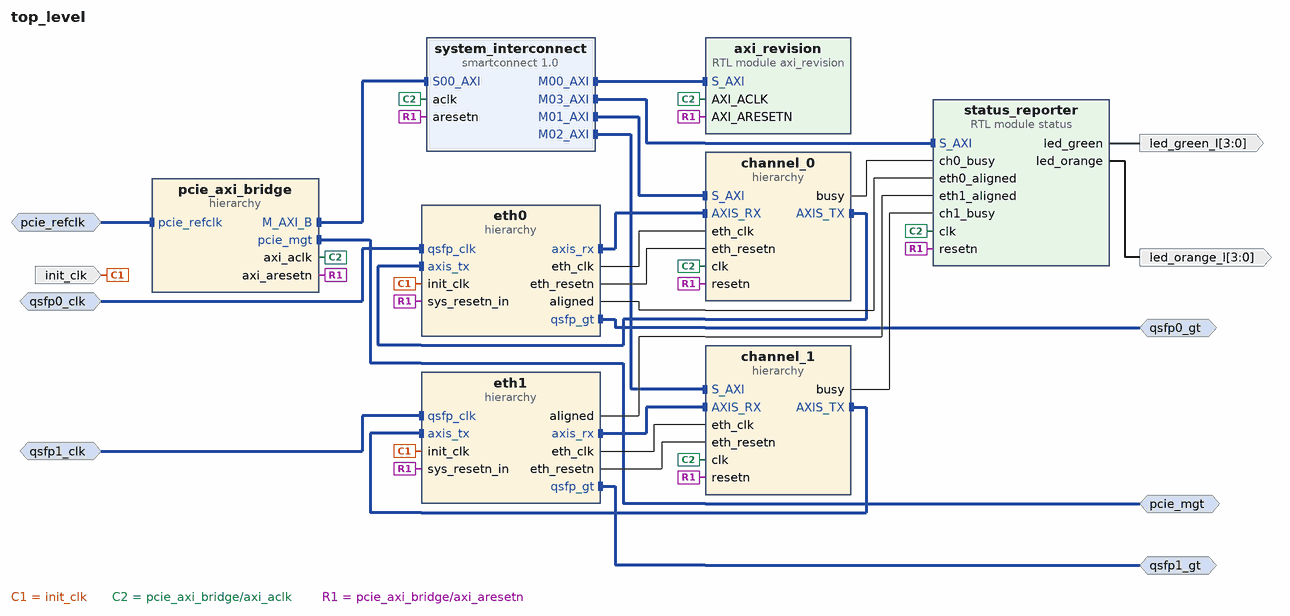
[diagram p0: block diagram of the top level]
# Vivado block design top_level, xcvu3p-ffvc1517-2-e, Vivado 2021.1
create_bd_design top_level

create_bd_intf_port -mode Slave -vlnv xilinx.com:interface:diff_clock_rtl:1.0 pcie_refclk
create_bd_intf_port -mode Master -vlnv xilinx.com:interface:pcie_7x_mgt_rtl:1.0 pcie_mgt
create_bd_intf_port -mode Master -vlnv xilinx.com:interface:gt_rtl:1.0 qsfp0_gt
create_bd_intf_port -mode Slave -vlnv xilinx.com:interface:diff_clock_rtl:1.0 qsfp0_clk
set_property -dict {CONFIG.FREQ_HZ 322265625} [get_bd_intf_ports qsfp0_clk]
create_bd_intf_port -mode Master -vlnv xilinx.com:interface:gt_rtl:1.0 qsfp1_gt
create_bd_intf_port -mode Slave -vlnv xilinx.com:interface:diff_clock_rtl:1.0 qsfp1_clk
set_property -dict {CONFIG.FREQ_HZ 322265625} [get_bd_intf_ports qsfp1_clk]
create_bd_port -dir I -type clk init_clk
create_bd_port -dir O -from 3 -to 0 led_green_l
create_bd_port -dir O -from 3 -to 0 led_orange_l

create_bd_cell -type hier pcie_axi_bridge
create_bd_cell -type ip -vlnv xilinx.com:ip:smartconnect:1.0 system_interconnect
set_property -dict {CONFIG.NUM_MI 4 CONFIG.NUM_SI 1} [get_bd_cells system_interconnect]
create_bd_cell -type hier eth0
create_bd_cell -type hier channel_0
create_bd_cell -type hier eth1
create_bd_cell -type hier channel_1
create_bd_cell -type module -reference axi_revision axi_revision
create_bd_cell -type module -reference status status_reporter
set_property -dict {CONFIG.ACTIVE_LOW_LED 1} [get_bd_cells status_reporter]

# ---- hierarchy /pcie_axi_bridge ----
current_bd_instance /pcie_axi_bridge
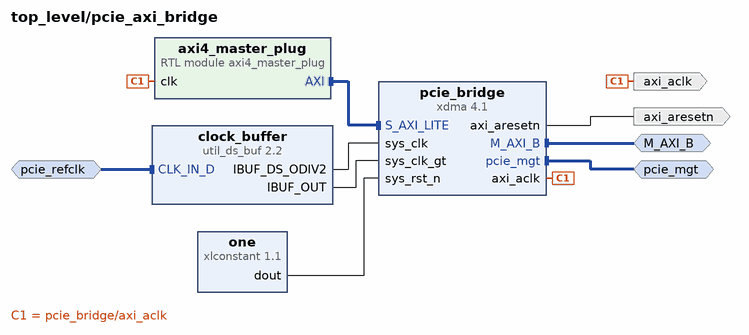
[diagram p1: block diagram inside /pcie_axi_bridge]
create_bd_intf_pin -mode Master -vlnv xilinx.com:interface:pcie_7x_mgt_rtl:1.0 pcie_mgt
create_bd_intf_pin -mode Slave -vlnv xilinx.com:interface:diff_clock_rtl:1.0 pcie_refclk
create_bd_intf_pin -mode Master -vlnv xilinx.com:interface:aximm_rtl:1.0 M_AXI_B
create_bd_pin -dir O axi_aresetn
create_bd_pin -dir O axi_aclk

create_bd_cell -type ip -vlnv xilinx.com:ip:xdma:4.1 pcie_bridge
set_property -dict [list \
  CONFIG.PF0_DEVICE_ID_mqdma 903F \
  CONFIG.PF0_SRIOV_VF_DEVICE_ID A03F \
  CONFIG.PF2_DEVICE_ID_mqdma 923F \
  CONFIG.PF3_DEVICE_ID_mqdma 933F \
  CONFIG.axi_addr_width 64 \
  CONFIG.axi_data_width 512_bit \
  CONFIG.axisten_freq 250 \
  CONFIG.bridge_burst true \
  CONFIG.en_axi_slave_if false \
  CONFIG.functional_mode AXI_Bridge \
  CONFIG.mode_selection Advanced \
  CONFIG.pf0_bar0_scale Megabytes \
  CONFIG.pf0_bar0_size 1 \
  CONFIG.pf0_device_id 903F \
  CONFIG.pl_link_cap_max_link_speed 8.0_GT/s \
  CONFIG.pl_link_cap_max_link_width X16 \
  CONFIG.plltype QPLL1 \
] [get_bd_cells pcie_bridge]
create_bd_cell -type ip -vlnv xilinx.com:ip:util_ds_buf:2.2 clock_buffer
set_property -dict {CONFIG.C_BUF_TYPE IBUFDSGTE} [get_bd_cells clock_buffer]
create_bd_cell -type ip -vlnv xilinx.com:ip:xlconstant:1.1 one
create_bd_cell -type module -reference axi4_master_plug axi4_master_plug

# ---- hierarchy /eth0 ----
current_bd_instance /eth0
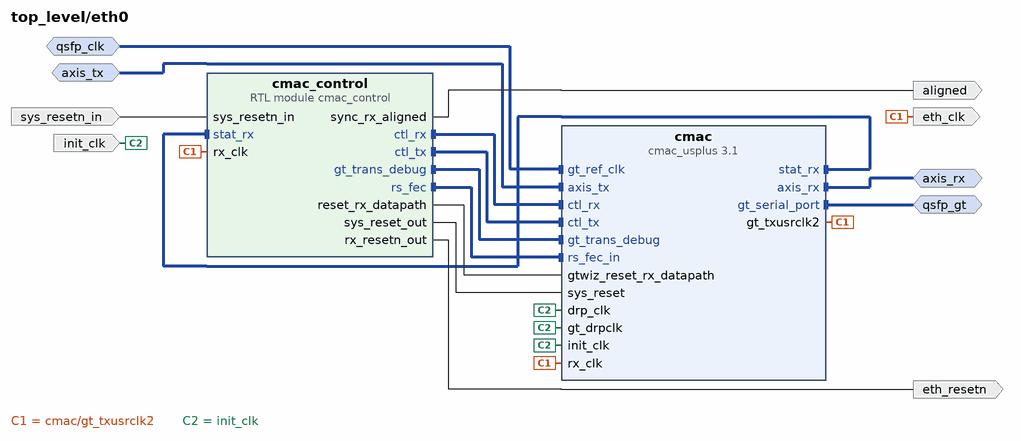
[diagram p2: block diagram inside /eth0]
create_bd_intf_pin -mode Master -vlnv xilinx.com:interface:gt_rtl:1.0 qsfp_gt
create_bd_intf_pin -mode Slave -vlnv xilinx.com:interface:diff_clock_rtl:1.0 qsfp_clk
create_bd_intf_pin -mode Master -vlnv xilinx.com:interface:axis_rtl:1.0 axis_rx
create_bd_intf_pin -mode Slave -vlnv xilinx.com:interface:axis_rtl:1.0 axis_tx
create_bd_pin -dir I -type clk init_clk
create_bd_pin -dir O eth_clk
create_bd_pin -dir O aligned
create_bd_pin -dir I sys_resetn_in
create_bd_pin -dir O eth_resetn

create_bd_cell -type ip -vlnv xilinx.com:ip:cmac_usplus:3.1 cmac
set_property -dict [list \
  CONFIG.ADD_GT_CNRL_STS_PORTS 1 \
  CONFIG.CMAC_CAUI4_MODE 1 \
  CONFIG.CMAC_CORE_SELECT CMACE4_X0Y2 \
  CONFIG.GT_GROUP_SELECT {X0Y16~X0Y19} \
  CONFIG.GT_REF_CLK_FREQ 322.265625 \
  CONFIG.INCLUDE_RS_FEC 1 \
  CONFIG.NUM_LANES 4x25 \
  CONFIG.RX_FLOW_CONTROL 0 \
  CONFIG.TX_FLOW_CONTROL 0 \
  CONFIG.USER_INTERFACE AXIS \
] [get_bd_cells cmac]
create_bd_cell -type module -reference cmac_control cmac_control

# ---- hierarchy /channel_0 ----
current_bd_instance /channel_0
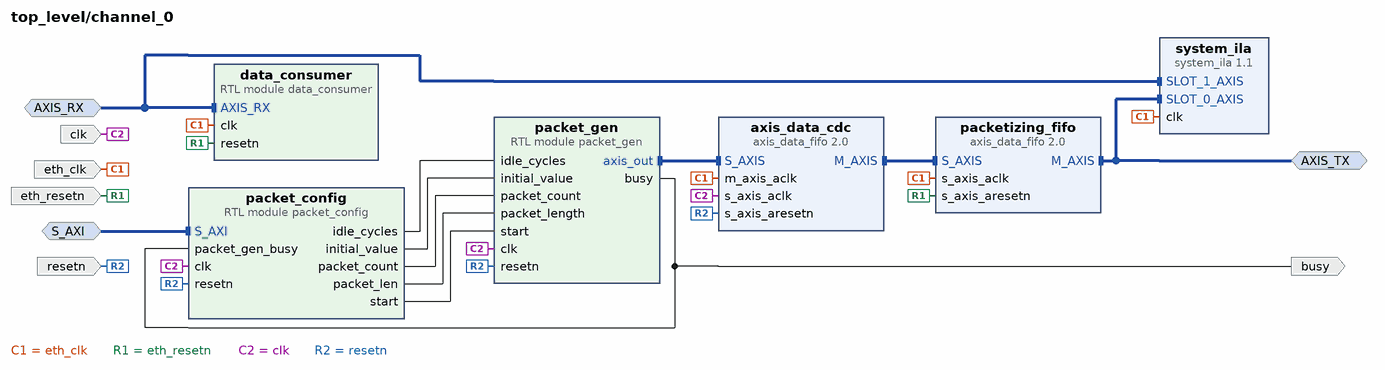
[diagram p3: block diagram inside /channel_0]
create_bd_intf_pin -mode Slave -vlnv xilinx.com:interface:aximm_rtl:1.0 S_AXI
create_bd_intf_pin -mode Master -vlnv xilinx.com:interface:axis_rtl:1.0 AXIS_TX
create_bd_intf_pin -mode Slave -vlnv xilinx.com:interface:axis_rtl:1.0 AXIS_RX
create_bd_pin -dir I -type rst resetn
create_bd_pin -dir I -type clk clk
create_bd_pin -dir I -type clk eth_clk
create_bd_pin -dir I -type rst eth_resetn
create_bd_pin -dir O busy

create_bd_cell -type ip -vlnv xilinx.com:ip:axis_data_fifo:2.0 axis_data_cdc
set_property -dict {CONFIG.FIFO_DEPTH 16 CONFIG.IS_ACLK_ASYNC 1} [get_bd_cells axis_data_cdc]
create_bd_cell -type module -reference packet_gen packet_gen
create_bd_cell -type ip -vlnv xilinx.com:ip:axis_data_fifo:2.0 packetizing_fifo
set_property -dict {CONFIG.FIFO_MODE 2} [get_bd_cells packetizing_fifo]
create_bd_cell -type module -reference data_consumer data_consumer
create_bd_cell -type ip -vlnv xilinx.com:ip:system_ila:1.1 system_ila
set_property -dict [list \
  CONFIG.C_NUM_MONITOR_SLOTS 2 \
  CONFIG.C_SLOT 1 \
  CONFIG.C_SLOT_0_INTF_TYPE xilinx.com:interface:axis_rtl:1.0 \
  CONFIG.C_SLOT_1_INTF_TYPE xilinx.com:interface:axis_rtl:1.0 \
] [get_bd_cells system_ila]
create_bd_cell -type module -reference packet_config packet_config

# ---- hierarchy /eth1 ----
current_bd_instance /eth1
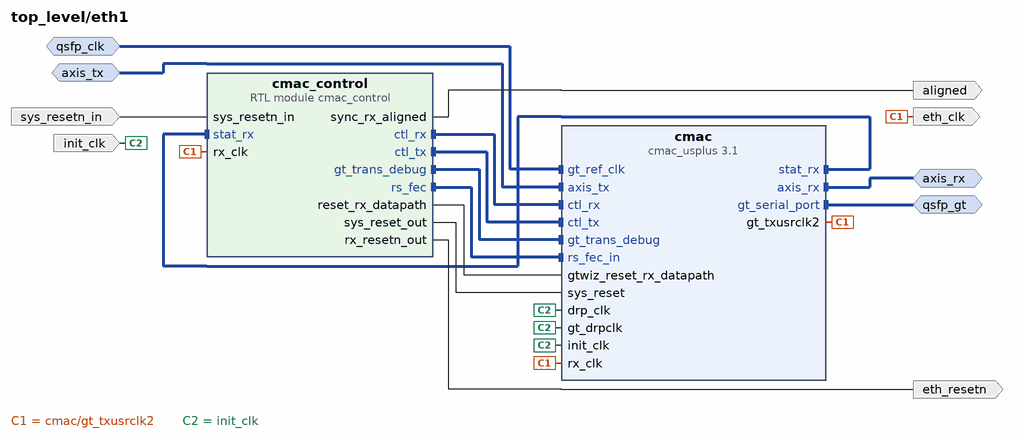
[diagram p4: block diagram inside /eth1]
create_bd_intf_pin -mode Master -vlnv xilinx.com:interface:gt_rtl:1.0 qsfp_gt
create_bd_intf_pin -mode Slave -vlnv xilinx.com:interface:diff_clock_rtl:1.0 qsfp_clk
create_bd_intf_pin -mode Master -vlnv xilinx.com:interface:axis_rtl:1.0 axis_rx
create_bd_intf_pin -mode Slave -vlnv xilinx.com:interface:axis_rtl:1.0 axis_tx
create_bd_pin -dir I -type clk init_clk
create_bd_pin -dir O eth_clk
create_bd_pin -dir O aligned
create_bd_pin -dir I sys_resetn_in
create_bd_pin -dir O eth_resetn

create_bd_cell -type ip -vlnv xilinx.com:ip:cmac_usplus:3.1 cmac
set_property -dict [list \
  CONFIG.ADD_GT_CNRL_STS_PORTS 1 \
  CONFIG.CMAC_CAUI4_MODE 1 \
  CONFIG.CMAC_CORE_SELECT CMACE4_X0Y0 \
  CONFIG.GT_GROUP_SELECT {X0Y4~X0Y7} \
  CONFIG.GT_REF_CLK_FREQ 322.265625 \
  CONFIG.INCLUDE_RS_FEC 1 \
  CONFIG.NUM_LANES 4x25 \
  CONFIG.RX_FLOW_CONTROL 0 \
  CONFIG.TX_FLOW_CONTROL 0 \
  CONFIG.USER_INTERFACE AXIS \
] [get_bd_cells cmac]
create_bd_cell -type module -reference cmac_control cmac_control

# ---- hierarchy /channel_1 ----
current_bd_instance /channel_1
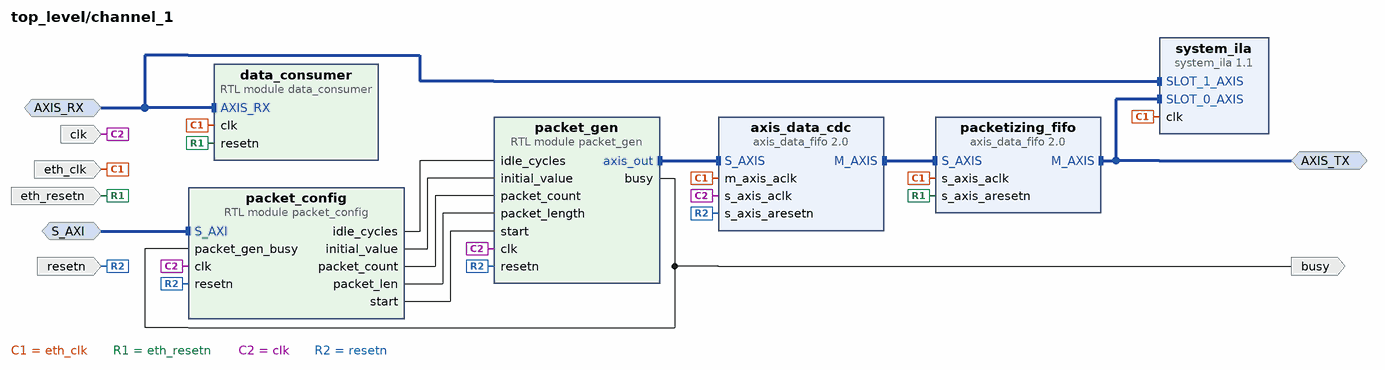
[diagram p5: block diagram inside /channel_1]
create_bd_intf_pin -mode Slave -vlnv xilinx.com:interface:aximm_rtl:1.0 S_AXI
create_bd_intf_pin -mode Master -vlnv xilinx.com:interface:axis_rtl:1.0 AXIS_TX
create_bd_intf_pin -mode Slave -vlnv xilinx.com:interface:axis_rtl:1.0 AXIS_RX
create_bd_pin -dir I -type rst resetn
create_bd_pin -dir I -type clk clk
create_bd_pin -dir I -type clk eth_clk
create_bd_pin -dir I -type rst eth_resetn
create_bd_pin -dir O busy

create_bd_cell -type ip -vlnv xilinx.com:ip:axis_data_fifo:2.0 axis_data_cdc
set_property -dict {CONFIG.FIFO_DEPTH 16 CONFIG.IS_ACLK_ASYNC 1} [get_bd_cells axis_data_cdc]
create_bd_cell -type module -reference packet_gen packet_gen
create_bd_cell -type ip -vlnv xilinx.com:ip:axis_data_fifo:2.0 packetizing_fifo
set_property -dict {CONFIG.FIFO_MODE 2} [get_bd_cells packetizing_fifo]
create_bd_cell -type module -reference data_consumer data_consumer
create_bd_cell -type ip -vlnv xilinx.com:ip:system_ila:1.1 system_ila
set_property -dict [list \
  CONFIG.C_NUM_MONITOR_SLOTS 2 \
  CONFIG.C_SLOT 1 \
  CONFIG.C_SLOT_0_INTF_TYPE xilinx.com:interface:axis_rtl:1.0 \
  CONFIG.C_SLOT_1_INTF_TYPE xilinx.com:interface:axis_rtl:1.0 \
] [get_bd_cells system_ila]
create_bd_cell -type module -reference packet_config packet_config
set_property -dict {CONFIG.DEFAULT_INIT_VALUE 0x8000} [get_bd_cells packet_config]

# ---- connections ----

current_bd_instance /pcie_axi_bridge
connect_bd_intf_net [get_bd_intf_pins pcie_refclk] [get_bd_intf_pins clock_buffer/CLK_IN_D]
connect_bd_intf_net [get_bd_intf_pins M_AXI_B] [get_bd_intf_pins pcie_bridge/M_AXI_B]
connect_bd_intf_net [get_bd_intf_pins axi4_master_plug/AXI] [get_bd_intf_pins pcie_bridge/S_AXI_LITE]
connect_bd_intf_net [get_bd_intf_pins pcie_mgt] [get_bd_intf_pins pcie_bridge/pcie_mgt]
connect_bd_net [get_bd_pins pcie_bridge/axi_aclk] [get_bd_pins axi_aclk] [get_bd_pins axi4_master_plug/clk]
connect_bd_net [get_bd_pins pcie_bridge/axi_aresetn] [get_bd_pins axi_aresetn]
connect_bd_net -net util_ds_buf_0_IBUF_DS_ODIV2 [get_bd_pins clock_buffer/IBUF_DS_ODIV2] [get_bd_pins pcie_bridge/sys_clk]
connect_bd_net -net util_ds_buf_0_IBUF_OUT [get_bd_pins clock_buffer/IBUF_OUT] [get_bd_pins pcie_bridge/sys_clk_gt]
connect_bd_net -net xlconstant_0_dout [get_bd_pins one/dout] [get_bd_pins pcie_bridge/sys_rst_n]

current_bd_instance /eth0
connect_bd_intf_net [get_bd_intf_pins qsfp_gt] [get_bd_intf_pins cmac/gt_serial_port]
connect_bd_intf_net [get_bd_intf_pins qsfp_clk] [get_bd_intf_pins cmac/gt_ref_clk]
connect_bd_intf_net [get_bd_intf_pins axis_tx] [get_bd_intf_pins cmac/axis_tx]
connect_bd_intf_net [get_bd_intf_pins axis_rx] [get_bd_intf_pins cmac/axis_rx]
connect_bd_intf_net [get_bd_intf_pins cmac_control/ctl_rx] [get_bd_intf_pins cmac/ctl_rx]
connect_bd_intf_net [get_bd_intf_pins cmac_control/ctl_tx] [get_bd_intf_pins cmac/ctl_tx]
connect_bd_intf_net [get_bd_intf_pins cmac_control/gt_trans_debug] [get_bd_intf_pins cmac/gt_trans_debug]
connect_bd_intf_net [get_bd_intf_pins cmac_control/rs_fec] [get_bd_intf_pins cmac/rs_fec_in]
connect_bd_intf_net [get_bd_intf_pins cmac_control/stat_rx] [get_bd_intf_pins cmac/stat_rx]
connect_bd_net [get_bd_pins cmac_control/reset_rx_datapath] [get_bd_pins cmac/gtwiz_reset_rx_datapath]
connect_bd_net [get_bd_pins cmac_control/rx_resetn_out] [get_bd_pins eth_resetn]
connect_bd_net [get_bd_pins cmac_control/sync_rx_aligned] [get_bd_pins aligned]
connect_bd_net [get_bd_pins cmac_control/sys_reset_out] [get_bd_pins cmac/sys_reset]
connect_bd_net [get_bd_pins cmac/gt_txusrclk2] [get_bd_pins eth_clk] [get_bd_pins cmac/rx_clk] [get_bd_pins cmac_control/rx_clk]
connect_bd_net -net init_clk_0_1 [get_bd_pins init_clk] [get_bd_pins cmac/init_clk] [get_bd_pins cmac/gt_drpclk] [get_bd_pins cmac/drp_clk]
connect_bd_net [get_bd_pins sys_resetn_in] [get_bd_pins cmac_control/sys_resetn_in]

current_bd_instance /channel_0
connect_bd_intf_net [get_bd_intf_pins axis_data_cdc/M_AXIS] [get_bd_intf_pins packetizing_fifo/S_AXIS]
connect_bd_intf_net [get_bd_intf_pins AXIS_RX] [get_bd_intf_pins data_consumer/AXIS_RX]
connect_bd_intf_net [get_bd_intf_pins AXIS_RX] [get_bd_intf_pins system_ila/SLOT_1_AXIS]
connect_bd_intf_net [get_bd_intf_pins AXIS_TX] [get_bd_intf_pins packetizing_fifo/M_AXIS]
connect_bd_intf_net [get_bd_intf_pins AXIS_TX] [get_bd_intf_pins system_ila/SLOT_0_AXIS]
connect_bd_intf_net [get_bd_intf_pins axis_data_cdc/S_AXIS] [get_bd_intf_pins packet_gen/axis_out]
connect_bd_intf_net [get_bd_intf_pins S_AXI] [get_bd_intf_pins packet_config/S_AXI]
connect_bd_net -net eth0_stream_clk [get_bd_pins eth_clk] \
  [get_bd_pins packetizing_fifo/s_axis_aclk] [get_bd_pins data_consumer/clk] [get_bd_pins axis_data_cdc/m_axis_aclk] \
  [get_bd_pins system_ila/clk]
connect_bd_net -net eth0_stream_resetn [get_bd_pins eth_resetn] [get_bd_pins packetizing_fifo/s_axis_aresetn] [get_bd_pins data_consumer/resetn]
connect_bd_net [get_bd_pins packet_config/idle_cycles] [get_bd_pins packet_gen/idle_cycles]
connect_bd_net [get_bd_pins packet_config/initial_value] [get_bd_pins packet_gen/initial_value]
connect_bd_net [get_bd_pins packet_config/packet_count] [get_bd_pins packet_gen/packet_count]
connect_bd_net [get_bd_pins packet_config/packet_len] [get_bd_pins packet_gen/packet_length]
connect_bd_net [get_bd_pins packet_config/start] [get_bd_pins packet_gen/start]
connect_bd_net [get_bd_pins packet_gen/busy] [get_bd_pins busy] [get_bd_pins packet_config/packet_gen_busy]
connect_bd_net -net pcie_bridge_axi_aclk [get_bd_pins clk] \
  [get_bd_pins packet_gen/clk] [get_bd_pins axis_data_cdc/s_axis_aclk] [get_bd_pins packet_config/clk]
connect_bd_net -net pcie_bridge_axi_aresetn [get_bd_pins resetn] \
  [get_bd_pins packet_gen/resetn] [get_bd_pins axis_data_cdc/s_axis_aresetn] [get_bd_pins packet_config/resetn]

current_bd_instance /eth1
connect_bd_intf_net [get_bd_intf_pins qsfp_gt] [get_bd_intf_pins cmac/gt_serial_port]
connect_bd_intf_net [get_bd_intf_pins qsfp_clk] [get_bd_intf_pins cmac/gt_ref_clk]
connect_bd_intf_net [get_bd_intf_pins axis_tx] [get_bd_intf_pins cmac/axis_tx]
connect_bd_intf_net [get_bd_intf_pins axis_rx] [get_bd_intf_pins cmac/axis_rx]
connect_bd_intf_net [get_bd_intf_pins cmac_control/ctl_rx] [get_bd_intf_pins cmac/ctl_rx]
connect_bd_intf_net [get_bd_intf_pins cmac_control/ctl_tx] [get_bd_intf_pins cmac/ctl_tx]
connect_bd_intf_net [get_bd_intf_pins cmac_control/gt_trans_debug] [get_bd_intf_pins cmac/gt_trans_debug]
connect_bd_intf_net [get_bd_intf_pins cmac_control/rs_fec] [get_bd_intf_pins cmac/rs_fec_in]
connect_bd_intf_net [get_bd_intf_pins cmac_control/stat_rx] [get_bd_intf_pins cmac/stat_rx]
connect_bd_net [get_bd_pins cmac_control/reset_rx_datapath] [get_bd_pins cmac/gtwiz_reset_rx_datapath]
connect_bd_net [get_bd_pins cmac_control/rx_resetn_out] [get_bd_pins eth_resetn]
connect_bd_net [get_bd_pins cmac_control/sync_rx_aligned] [get_bd_pins aligned]
connect_bd_net [get_bd_pins cmac_control/sys_reset_out] [get_bd_pins cmac/sys_reset]
connect_bd_net [get_bd_pins cmac/gt_txusrclk2] [get_bd_pins eth_clk] [get_bd_pins cmac/rx_clk] [get_bd_pins cmac_control/rx_clk]
connect_bd_net -net init_clk_0_1 [get_bd_pins init_clk] [get_bd_pins cmac/init_clk] [get_bd_pins cmac/gt_drpclk] [get_bd_pins cmac/drp_clk]
connect_bd_net [get_bd_pins sys_resetn_in] [get_bd_pins cmac_control/sys_resetn_in]

current_bd_instance /channel_1
connect_bd_intf_net [get_bd_intf_pins axis_data_cdc/M_AXIS] [get_bd_intf_pins packetizing_fifo/S_AXIS]
connect_bd_intf_net [get_bd_intf_pins AXIS_RX] [get_bd_intf_pins data_consumer/AXIS_RX]
connect_bd_intf_net [get_bd_intf_pins AXIS_RX] [get_bd_intf_pins system_ila/SLOT_1_AXIS]
connect_bd_intf_net [get_bd_intf_pins AXIS_TX] [get_bd_intf_pins packetizing_fifo/M_AXIS]
connect_bd_intf_net [get_bd_intf_pins AXIS_TX] [get_bd_intf_pins system_ila/SLOT_0_AXIS]
connect_bd_intf_net [get_bd_intf_pins axis_data_cdc/S_AXIS] [get_bd_intf_pins packet_gen/axis_out]
connect_bd_intf_net [get_bd_intf_pins S_AXI] [get_bd_intf_pins packet_config/S_AXI]
connect_bd_net -net eth0_stream_clk [get_bd_pins eth_clk] \
  [get_bd_pins packetizing_fifo/s_axis_aclk] [get_bd_pins data_consumer/clk] [get_bd_pins axis_data_cdc/m_axis_aclk] \
  [get_bd_pins system_ila/clk]
connect_bd_net -net eth0_stream_resetn [get_bd_pins eth_resetn] [get_bd_pins packetizing_fifo/s_axis_aresetn] [get_bd_pins data_consumer/resetn]
connect_bd_net [get_bd_pins packet_config/idle_cycles] [get_bd_pins packet_gen/idle_cycles]
connect_bd_net [get_bd_pins packet_config/initial_value] [get_bd_pins packet_gen/initial_value]
connect_bd_net [get_bd_pins packet_config/packet_count] [get_bd_pins packet_gen/packet_count]
connect_bd_net [get_bd_pins packet_config/packet_len] [get_bd_pins packet_gen/packet_length]
connect_bd_net [get_bd_pins packet_config/start] [get_bd_pins packet_gen/start]
connect_bd_net [get_bd_pins packet_gen/busy] [get_bd_pins busy] [get_bd_pins packet_config/packet_gen_busy]
connect_bd_net -net pcie_bridge_axi_aclk [get_bd_pins clk] \
  [get_bd_pins packet_gen/clk] [get_bd_pins axis_data_cdc/s_axis_aclk] [get_bd_pins packet_config/clk]
connect_bd_net [get_bd_pins resetn] [get_bd_pins packet_gen/resetn] [get_bd_pins axis_data_cdc/s_axis_aresetn] [get_bd_pins packet_config/resetn]

current_bd_instance /
connect_bd_intf_net [get_bd_intf_pins channel_1/AXIS_RX] [get_bd_intf_pins eth1/axis_rx]
connect_bd_intf_net [get_bd_intf_ports pcie_refclk] [get_bd_intf_pins pcie_axi_bridge/pcie_refclk]
connect_bd_intf_net [get_bd_intf_pins channel_0/AXIS_TX] [get_bd_intf_pins eth0/axis_tx]
connect_bd_intf_net [get_bd_intf_pins channel_1/AXIS_TX] [get_bd_intf_pins eth1/axis_tx]
connect_bd_intf_net [get_bd_intf_pins channel_0/AXIS_RX] [get_bd_intf_pins eth0/axis_rx]
connect_bd_intf_net [get_bd_intf_ports qsfp0_gt] [get_bd_intf_pins eth0/qsfp_gt]
connect_bd_intf_net [get_bd_intf_ports qsfp1_gt] [get_bd_intf_pins eth1/qsfp_gt]
connect_bd_intf_net [get_bd_intf_ports qsfp0_clk] [get_bd_intf_pins eth0/qsfp_clk]
connect_bd_intf_net [get_bd_intf_pins system_interconnect/S00_AXI] [get_bd_intf_pins pcie_axi_bridge/M_AXI_B]
connect_bd_intf_net [get_bd_intf_ports pcie_mgt] [get_bd_intf_pins pcie_axi_bridge/pcie_mgt]
connect_bd_intf_net [get_bd_intf_ports qsfp1_clk] [get_bd_intf_pins eth1/qsfp_clk]
connect_bd_intf_net [get_bd_intf_pins axi_revision/S_AXI] [get_bd_intf_pins system_interconnect/M00_AXI]
connect_bd_intf_net [get_bd_intf_pins channel_0/S_AXI] [get_bd_intf_pins system_interconnect/M01_AXI]
connect_bd_intf_net [get_bd_intf_pins system_interconnect/M02_AXI] [get_bd_intf_pins channel_1/S_AXI]
connect_bd_intf_net [get_bd_intf_pins system_interconnect/M03_AXI] [get_bd_intf_pins status_reporter/S_AXI]
connect_bd_net [get_bd_pins channel_0/busy] [get_bd_pins status_reporter/ch0_busy]
connect_bd_net [get_bd_pins channel_1/busy] [get_bd_pins status_reporter/ch1_busy]
connect_bd_net [get_bd_pins eth0/aligned] [get_bd_pins status_reporter/eth0_aligned]
connect_bd_net -net eth0_stream_clk [get_bd_pins eth0/eth_clk] [get_bd_pins channel_0/eth_clk]
connect_bd_net -net eth0_stream_resetn [get_bd_pins eth0/eth_resetn] [get_bd_pins channel_0/eth_resetn]
connect_bd_net [get_bd_pins eth1/aligned] [get_bd_pins status_reporter/eth1_aligned]
connect_bd_net [get_bd_pins eth1/eth_clk] [get_bd_pins channel_1/eth_clk]
connect_bd_net [get_bd_pins eth1/eth_resetn] [get_bd_pins channel_1/eth_resetn]
connect_bd_net -net init_clk_0_1 [get_bd_ports init_clk] [get_bd_pins eth0/init_clk] [get_bd_pins eth1/init_clk]
connect_bd_net -net pcie_bridge_axi_aclk [get_bd_pins pcie_axi_bridge/axi_aclk] \
  [get_bd_pins system_interconnect/aclk] [get_bd_pins channel_0/clk] [get_bd_pins channel_1/clk] \
  [get_bd_pins axi_revision/AXI_ACLK] [get_bd_pins status_reporter/clk]
connect_bd_net -net pcie_bridge_axi_aresetn [get_bd_pins pcie_axi_bridge/axi_aresetn] \
  [get_bd_pins system_interconnect/aresetn] [get_bd_pins eth0/sys_resetn_in] [get_bd_pins channel_0/resetn] \
  [get_bd_pins eth1/sys_resetn_in] [get_bd_pins channel_1/resetn] [get_bd_pins axi_revision/AXI_ARESETN] \
  [get_bd_pins status_reporter/resetn]
connect_bd_net -net status_reporter_green_led_l [get_bd_pins status_reporter/led_green] [get_bd_ports led_green_l]
connect_bd_net -net status_reporter_orang_led_1 [get_bd_pins status_reporter/led_orange] [get_bd_ports led_orange_l]

# ---- address map ----
assign_bd_address -offset 0x00000000 -range 512M -target_address_space [get_bd_addr_spaces pcie_axi_bridge/axi4_master_plug/AXI] [get_bd_addr_segs pcie_axi_bridge/pcie_bridge/S_AXI_LITE/CTL0]
assign_bd_address -offset 0x0000000000000000 -range 256 -target_address_space [get_bd_addr_spaces pcie_axi_bridge/pcie_bridge/M_AXI_B] [get_bd_addr_segs axi_revision/S_AXI/reg0]
assign_bd_address -offset 0x0000000000001000 -range 256 -target_address_space [get_bd_addr_spaces pcie_axi_bridge/pcie_bridge/M_AXI_B] [get_bd_addr_segs channel_0/packet_config/S_AXI/reg0]
assign_bd_address -offset 0x0000000000002000 -range 256 -target_address_space [get_bd_addr_spaces pcie_axi_bridge/pcie_bridge/M_AXI_B] [get_bd_addr_segs channel_1/packet_config/S_AXI/reg0]
assign_bd_address -offset 0x0000000000003000 -range 256 -target_address_space [get_bd_addr_spaces pcie_axi_bridge/pcie_bridge/M_AXI_B] [get_bd_addr_segs status_reporter/S_AXI/reg0]

validate_bd_design
save_bd_design
